# Altium project RF19_Sensor_CAN_Module.PrjPcb
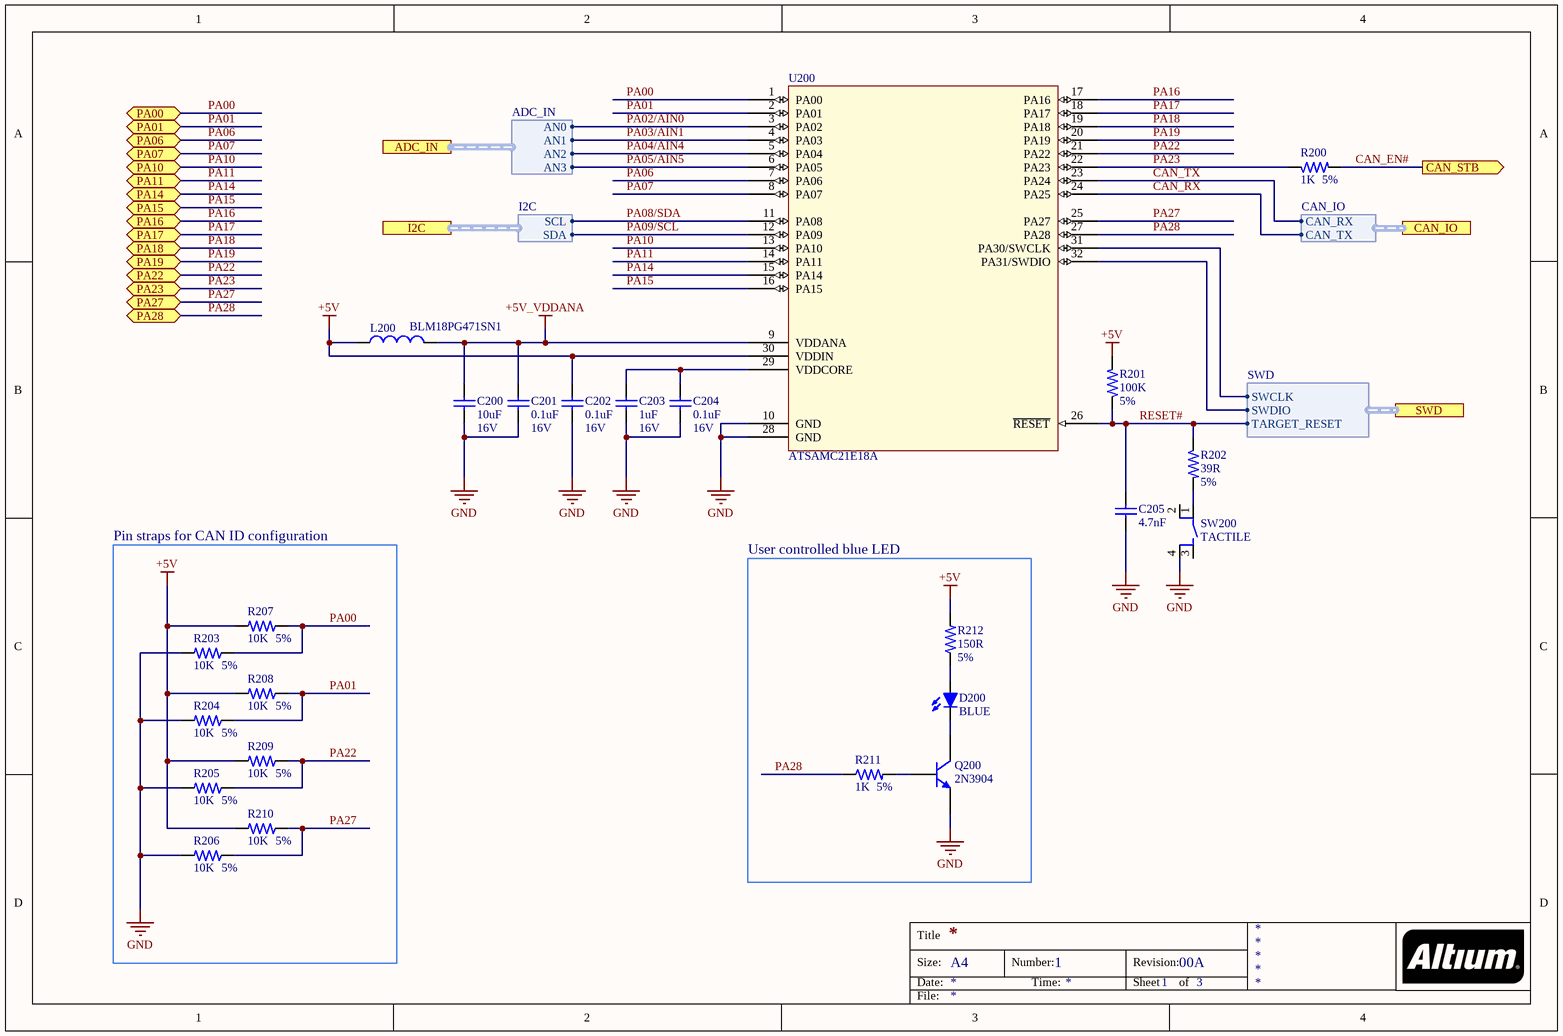
[diagram p0: RF19_Sensor_CAN_Module_MCU.SchDoc]
3 sheets, 64 parts. Net scope: flat (ports and power ports of the same name join across sheets).
Board file: RF19_Sensor_CAN_Module.PcbDoc
Sheets:
  RF19_Sensor_CAN_Module_MCU.SchDoc
  RF19_Sensor_CAN_Module_Power.SchDoc
  RF19_Sensor_CAN_Module_Interfaces.SchDoc

## Sheet RF19_Sensor_CAN_Module_MCU.SchDoc
size A4; Author: Tal Zaitsev; CompanyName: Ryerson Formula Racing; Engineer: Tal Zaitsev; DocumentNumber: 1; Revision: 00A; SheetNumber: 1; SheetTotal: 3

### Parts
C200  value 10uF  Voltage: 16V  [C0603]  (hidden comment: CERAMIC CAP)
C201  value 0.1uF  Voltage: 16V  [C0402]  (hidden comment: CERAMIC CAP)
C202  value 0.1uF  Voltage: 16V  [C0402]  (hidden comment: CERAMIC CAP)
C203  value 1uF  Voltage: 16V  [C0402]  (hidden comment: CERAMIC CAP)
C204  value 0.1uF  Voltage: 16V  [C0402]  (hidden comment: CERAMIC CAP)
C205  value 4.7nF  [C0402]  (hidden comment: CAP CERAMIC)
D200  BLUE  [0603 LED]
L200  value BLM18PG471SN1  [L0603_MURATA]
Q200  2N3904  [SOT323-3L]
R200  value 1K  Tolerance: 5%  [R0402]  (hidden comment: R001K50P0402063)
R201  value 100K  Tolerance: 5%  [R0402]  (hidden comment: R100K50P0402063)
R202  value 39R  Tolerance: 5%  [R0402]  (hidden comment: R039R50P0402063)
R203  value 10K  Tolerance: 5%  [R0402]  (hidden comment: R010K50P0402063)
R204  value 10K  Tolerance: 5%  [R0402]  (hidden comment: R010K50P0402063)
R205  value 10K  Tolerance: 5%  [R0402]  (hidden comment: R010K50P0402063)
R206  value 10K  Tolerance: 5%  [R0402]  (hidden comment: R010K50P0402063)
R207  value 10K  Tolerance: 5%  [R0402]  (hidden comment: R010K50P0402063)
R208  value 10K  Tolerance: 5%  [R0402]  (hidden comment: R010K50P0402063)
R209  value 10K  Tolerance: 5%  [R0402]  (hidden comment: R010K50P0402063)
R210  value 10K  Tolerance: 5%  [R0402]  (hidden comment: R010K50P0402063)
R211  value 1K  Tolerance: 5%  [R0402]  (hidden comment: R001K50P0402063)
R212  value 150R  Tolerance: 5%  [R0402]  (hidden comment: R150R50P0402063)
SW200  TACTILE  [TACTILE GULL WING KMR7]
U200  ATSAMC21E18A  [ATMEL_TQFP-32]

### Blocks framed on the sheet
Pin straps for CAN ID configuration: R203-R210
User controlled blue LED: D200 Q200 R211 R212

### Ports
ADC_IN (harness ADC_IN), CAN_IO (harness CAN_IO), CAN_STB (out), I2C (harness I2C), PA00 (bidir), PA01 (bidir), PA06 (bidir), PA07 (bidir), PA10 (bidir), PA11 (bidir), PA14 (bidir), PA15 (bidir), PA16 (bidir), PA17 (bidir), PA18 (bidir), PA19 (bidir), PA22 (bidir), PA23 (bidir), PA27 (bidir), PA28 (bidir), SWD (harness SWD)

### Harnesses
SWD: SWCLK, SWDIO, TARGET_RESET
CAN_IO: CAN_RX, CAN_TX
ADC_IN: AN0, AN1, AN2, AN3
I2C: SCL, SDA

### Nets
+5V: C202.1 L200.1 R201.2 R207.2 R208.2 R209.2 R210.2 R212.2 U200.30(VDDIN)
+5V_VDDANA: C200.1 C201.1 L200.2 U200.9(VDDANA)
GND: C200.2 C201.2 C202.2 C203.2 C204.2 C205.2 Q200.3(E) R203.2 R204.2 R205.2 R206.2 SW200.4 U200.10(GND) U200.28(GND)
CAN_EN#: R200.2 ; port CAN_STB
CAN_RX: U200.24(PA25) ; port CAN_IO.CAN_TX
CAN_TX: U200.23(PA24) ; port CAN_IO.CAN_RX
PA00: R203.1 R207.1 U200.1(PA00) ; port PA00
PA01: R204.1 R208.1 U200.2(PA01) ; port PA01
PA02/AIN0: U200.3(PA02) ; port ADC_IN.AN0
PA03/AIN1: U200.4(PA03) ; port ADC_IN.AN1
PA04/AIN4: U200.5(PA04) ; port ADC_IN.AN2
PA05/AIN5: U200.6(PA05) ; port ADC_IN.AN3
PA06: U200.7(PA06) ; port PA06
PA07: U200.8(PA07) ; port PA07
PA08/SDA: U200.11(PA08) ; port I2C.SCL
PA09/SCL: U200.12(PA09) ; port I2C.SDA
PA10: U200.13(PA10) ; port PA10
PA11: U200.14(PA11) ; port PA11
PA14: U200.15(PA14) ; port PA14
PA15: U200.16(PA15) ; port PA15
PA16: U200.17(PA16) ; port PA16
PA17: U200.18(PA17) ; port PA17
PA18: U200.19(PA18) ; port PA18
PA19: U200.20(PA19) ; port PA19
PA22: R205.1 R209.1 U200.21(PA22) ; port PA22
PA23: R200.1 U200.22(PA23) ; port PA23
PA27: R206.1 R210.1 U200.25(PA27) ; port PA27
PA28: R211.1 U200.27(PA28) ; port PA28
RESET#: C205.1 R201.1 R202.1 U200.26(~{RESET}) ; port SWD.TARGET_RESET
NetC203_1: C203.1 C204.1 U200.29(VDDCORE)
NetD200_A: D200.A R212.1
NetD200_C: D200.C Q200.1(C)
NetJ100_2: U200.32(PA31/SWDIO) ; port SWD.SWDIO
NetJ100_4: U200.31(PA30/SWCLK) ; port SWD.SWCLK
NetQ200_2: Q200.2(B) R211.2
NetR202_2: R202.2 SW200.1

Not connected (* = marked no-connect by the designer): SW200 2 3

### Notes on the sheet
- Title
- Size:
- Date:
- A4
- Number:
- Time:
- Revision:
- Sheet
- of
- File:

### Library data of the parts
C200 = C010U10P16VX5R0603: Ceramic cap, 10uF +/-10% 16V X5R 0603; Supplier 1: Mouser; Supplier 2: Digi-Key; Supplier Part Number 1: 81-GRM188R61C106KALD; Supplier Part Number 2: 490-10728-1-ND
C201 C202 C204 = C00U110P16VX5R0402: Ceramic cap, 0.1uF +/-10% 16V X5R 0402; Supplier 1: Mouser; Supplier Part Number 1: 581-0402YD104K; Supplier 2: Digi-Key; Supplier Part Number 2: 478-1126-1-ND
C203 = C001U10P16VX5R0402: Ceramic cap, 1uF +/-10% 16V X5R 0402; Supplier 1: Mouser; Supplier 2: Digi-Key; Supplier Part Number 1: 963-EMK105BJ105KV-F; Supplier Part Number 2: 1276-1067-1-ND
C205 = CAP CERAMIC: Ceramic capacitor
D200 = D0603BLUE: LED Blue, 0603 3.3V 20mA; Supplier 1: Mouser; Supplier Part Number 1: 859-LTST-C191TBKT; ComponentLink1Description: Datasheet; ComponentLink1URL: http://optoelectronics.liteon.com/upload/download/DS22-2000-230/LTST-C191TBKT.pdf; Supplier 2: Digi-Key; Supplier Part Number 2: 160-1647-6-ND
L200 = A03-0035: SMD RF inductor 0603. Z=470Ohm (@100MHz), Max R(dc)=0.65Ohm, Max current=1A; PartGroup: Inductors,EMI; Manufacturer: Murata; Tolerance: ±25%; TemperatureRange: -55°C to +125°C; AN: A03-0035; Height: 0,800000011920929; MPN: BLM18PG471SN1; Supplier 1: Digi-Key; Supplier Part Number 1: 490-5223-1-ND; Supplier 2: Mouser; Supplier Part Number 2: 81-BLM18PG471SN1D
Q200 = QNPN: NPN Bipolar Transistor; Published: 8-Jun-2000; LatestRevisionDate: 29-May-2009; LatestRevisionNote: IPC-7351 Footprint Added.; PackageVersion: Aug-1999; PackageReference: SOT-23B; Publisher: Altium Limited; PackageDescription: 3-Pin SOT-23 Package 0.95 mm Pitch, 2.4 mm Lead Span; Supplier 1: Digi-Key; Supplier Part Number 1: MMBT3904WT1GOSDKR-ND; Supplier 2: Mouser; Supplier Part Number 2: 863-MMBT3904WT1G
R200 R211 = R001K50P0402063: Resistor 1K 5% 0402 1/16W; Supplier 1: Mouser; Supplier Part Number 1: 603-RC0402JR-071KL; ComponentLink1Description: Datasheet; ComponentLink1URL: http://www.yageo.com/documents/recent/PYu-RC_Group_51_RoHS_L_9.pdf; Supplier 2: Digi-Key; Supplier Part Number 2: 311-1.0KJRDKR-ND
R201 = R100K50P0402063: Resistor 100K 5% 0402 1/16W; Supplier 1: Mouser; Supplier Part Number 1: 603-RC0402JR-07100KL; ComponentLink1Description: Datasheet; ComponentLink1URL: http://www.yageo.com/documents/recent/PYu-RC_Group_51_RoHS_L_9.pdf; Supplier Part Number 2: 311-100KJRDKR-ND; Supplier 2: Digi-Key
R202 = R039R50P0402063: Resistor 39R 5% 0402 1/16W; Supplier 1: Mouser; Supplier Part Number 1: 603-RC0402JR-0739RL; Supplier 2: Digi-Key; Supplier Part Number 2: 311-39JRCT-ND; ComponentLink1Description: Datasheet; ComponentLink1URL: http://www.yageo.com/documents/recent/PYu-RC_Group_51_RoHS_L_9.pdf
R203-R210 = R010K50P0402063: Resistor 10K 5% 0402 1/16W; Supplier 1: Digi-Key; Supplier Part Number 1: 311-10KJRDKR-ND; ComponentLink1Description: Datasheet; ComponentLink1URL: http://www.yageo.com/documents/recent/PYu-RC_Group_51_RoHS_L_9.pdf; Supplier 2: Mouser; Supplier Part Number 2: 603-RC0402JR-0710KL
R212 = R150R50P0402063: Resistor 150R 5% 0402 1/16W; Supplier 1: Mouser; Supplier Part Number 1: 603-RC0402JR-07150RL; ComponentLink1Description: Datasheet; ComponentLink1URL: http://www.yageo.com/documents/recent/PYu-RC_Group_51_RoHS_L_9.pdf; Supplier 2: Digi-Key; Supplier Part Number 2: 311-150JRDKR-ND
SW200 = SWITCH TACTILE ALT: Tactile Switch SPST-NO Top Actuated Surface Mount; Supplier 1: Mouser; Supplier Part Number 1: 611-PTS810SJS250SMTR; ComponentLink1Description: Datasheet; ComponentLink1URL: https://www.ckswitches.com/media/1476/pts810.pdf; Supplier 2: Digi-Key; Supplier Part Number 2: CKN10878CT-ND
U200 = ATSAMC21E18A: Atmel SAM ARM Cortex-M0+ 32-bit MCU

## Sheet RF19_Sensor_CAN_Module_Power.SchDoc
size A; DocumentNumber: 2; SheetNumber: 2; SheetTotal: 3
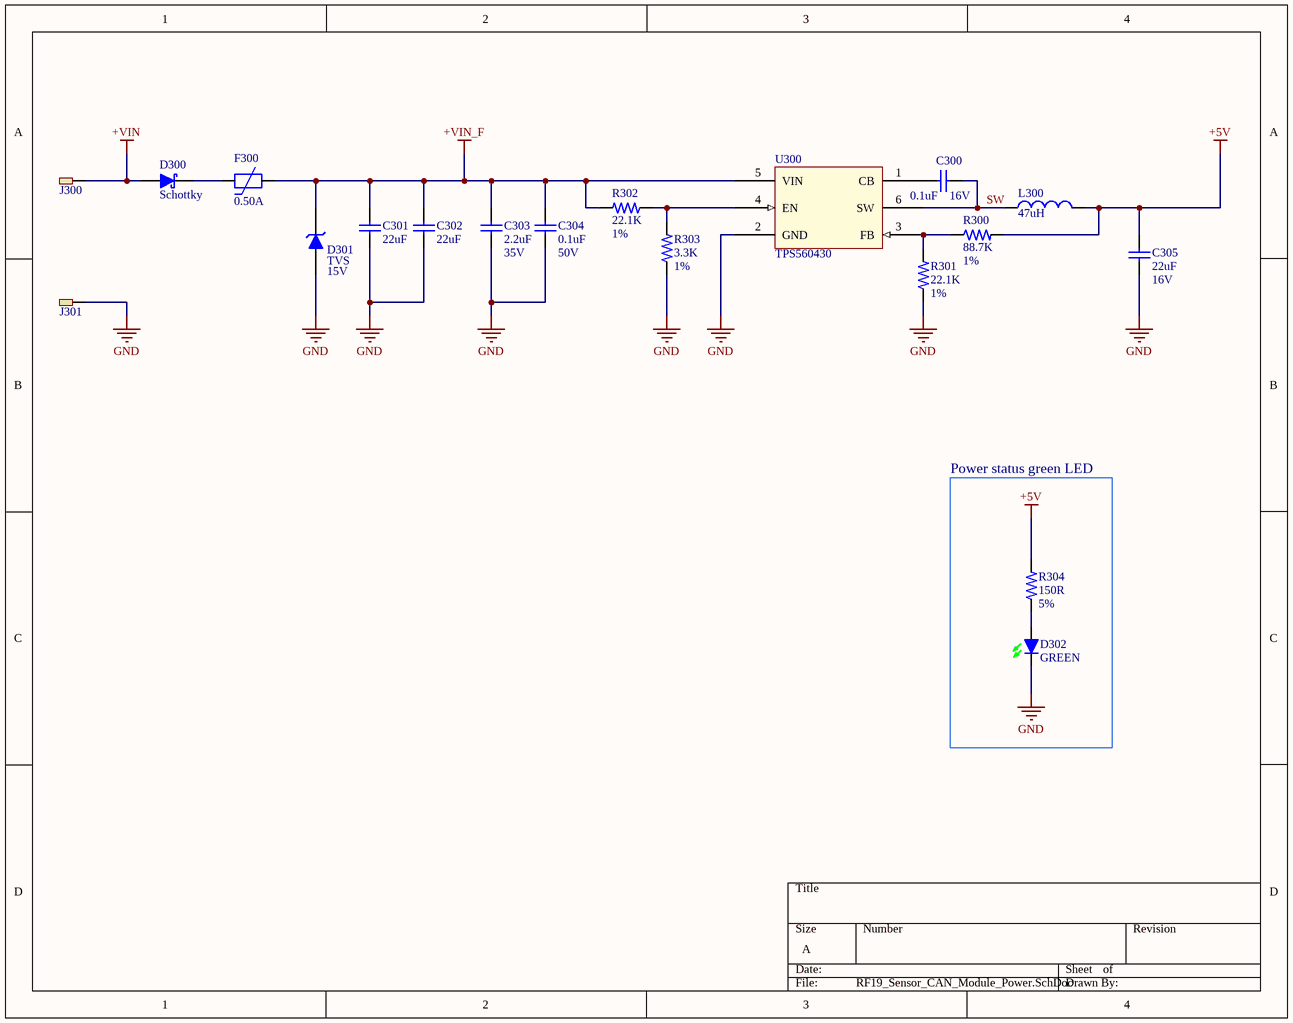
[diagram p1: RF19_Sensor_CAN_Module_Power.SchDoc]

### Parts
C300  value 0.1uF  Voltage: 16V  [C0402]  (hidden comment: C00U110P16VX5R0402)
C301  value 22uF  [C1206]  (hidden comment: CERAMIC CAP)
C302  value 22uF  [C1206]  (hidden comment: CERAMIC CAP)
C303  value 2.2uF  Voltage: 35V  [C0603]  (hidden comment: C02U210P35VX5R0603)
C304  value 0.1uF  Voltage: 50V  [C0603]  (hidden comment: CERAMIC CAP)
C305  value 22uF  Voltage: 16V  [C0805]  (hidden comment: CERAMIC CAP)
D300  Schottky  [SOD-123W]
D301  TVS  value 15V  [DO-214AC]
D302  GREEN  [0603 LED]
F300  0.50A  [PTC 1206]
J300  BREAKOUT  [BREAKOOUT PAD]  (value not drawn)  (no BOM)
J301  BREAKOUT  [BREAKOOUT PAD]  (value not drawn)  (no BOM)
L300  value 47uH  [SRN4018TA]  (hidden comment: Inductor)
R300  value 88.7K  Tolerance: 1%  [R0402]  (hidden comment: R88K710P0402063)
R301  value 22.1K  Tolerance: 1%  [R0402]  (hidden comment: R22K110P0402063)
R302  value 22.1K  Tolerance: 1%  [R0402]  (hidden comment: R22K110P0402063)
R303  value 3.3K  Tolerance: 1%  [R0402]  (hidden comment: R03K310P0402063)
R304  value 150R  Tolerance: 5%  [R0402]  (hidden comment: R150R50P0402063)
U300  TPS560430  [TI_SOP8_R-PDSO-G6]

### Blocks framed on the sheet
Power status green LED: D302 R304

### Nets
+5V: C305.1 L300.2 R300.2 R304.2
+VIN: D300.A J300.1
+VIN_F: C301.1 C302.1 C303.1 C304.1 D301.C F300.2 R302.2 U300.5(VIN)
GND: C301.2 C302.2 C303.2 C304.2 C305.2 D301.A D302.C J301.1 R301.1 R303.1 U300.2(GND)
SW: C300.1 L300.1 U300.6(SW)
NetC300_2: C300.2 U300.1(CB)
NetD300_C: D300.C F300.1
NetD302_A: D302.A R304.1
NetR300_1: R300.1 R301.2 U300.3(FB)
NetR302_1: R302.1 R303.2 U300.4(EN)

### Library data of the parts
C300 = C00U110P16VX5R0402: Ceramic cap, 0.1uF +/-10% 16V X5R 0402; Supplier 1: Mouser; Supplier 2: Digi-Key; Supplier Part Number 1: 581-0402YD104K; Supplier Part Number 2: 478-1126-1-ND
C301 C302 = CAP CERAMIC: Ceramic capacitor
C303 = C02U210P35VX5R0603: Ceramic cap, 2.2uF +/-10% 35V X5R 0603; Supplier 1: Mouser; Supplier Part Number 1: 81-GRM188R6YA225KA2D; Supplier 2: Digi-Key; Supplier Part Number 2: 490-7204-1-ND
C304 = C00U110P50VX7R0603: Ceramic cap, 0.1uF +/-10% 50V X7R 0603; Supplier 1: Mouser; Supplier Part Number 1: 80-C0603C104K5REAUTO; Supplier 2: Digi-Key; Supplier Part Number 2: 399-14105-1-ND
C305 = C022U20P16VX5R0805: Ceramic cap, 22uF +/-20% 16V X5R 0805; Supplier 1: Mouser; Supplier Part Number 1: 81-GRM219R61C226ME1K
D300 = DIODE SCHOTTKY: High speed Schottky Diode; Supplier 1: Mouser; Supplier Part Number 1: 771-PMEG6020ER-115; Supplier 2: Digi-Key; Supplier Part Number 2: 1727-5217-1-ND
D301 = DIODE TVS: TVS protection diode; Power: 1W; Supplier 1: Mouser; Supplier Part Number 1: 621-SMAJ15A-13-F; Supplier 2: Digi-Key; Supplier Part Number 2: SMAJ15A-FDICT-ND
D302 = D0603GREEN: LED Green, 0603 2.0V 20mA; ComponentLink1Description: Datasheet; ComponentLink1URL: http://optoelectronics.liteon.com/upload/download/DS22-2000-230/LTST-C191TBKT.pdf; Supplier 1: Mouser; Supplier 2: Digi-Key; Supplier Part Number 1: 859-LTST-C190KGKT; Supplier Part Number 2: 160-1435-6-ND
F300 = PTC: PTC RESETTBLE 0.50A 9V 0805; Supplier 1: Mouser; Supplier Part Number 1: 530-0ZCJ0050AF2E; Supplier 2: Digi-Key; Supplier Part Number 2: 507-1803-1-ND
J300 J301 = BREAKOUT: Breakout pad for later extension
L300 = Inductor: Code_IEC: 1005; Published: 8-Jun-2000; LatestRevisionDate: 29-May-2009; LatestRevisionNote: IPC-7351 Footprint Added.; PackageReference: 0402-A; Publisher: Altium Limited; PackageDescription: Chip Inductor; Code_JEITA: 0402; Supplier 1: Mouser; Supplier Part Number 1: 652-SRN4018TA-470M; Supplier 2: Digi-Key; Supplier Part Number 2: SRN4018TA-470MCT-ND
R300 = R88K710P0402063: Resistor 88.7K 1% 0402 1/16W; ComponentLink1Description: Datasheet; ComponentLink1URL: http://www.yageo.com/documents/recent/PYu-RC_Group_51_RoHS_L_9.pdf; Supplier 1: Mouser; Supplier Part Number 1: 603-RC0402FR-0788K7L; Supplier 2: Digi-Key; Supplier Part Number 2: 311-88.7KLRCT-ND; Supplier 3: Mouser; Supplier Part Number 3: 603-AC0402FR-0788K7L
R301 R302 = R22K110P0402063: Resistor 22.1K 1% 0402 1/16W; ComponentLink1Description: Datasheet; ComponentLink1URL: http://www.yageo.com/documents/recent/PYu-RC_Group_51_RoHS_L_9.pdf; Supplier 1: Mouser; Supplier Part Number 1: 603-RC0402FR-0722K1L; Supplier 2: Digi-Key; Supplier Part Number 2: 311-22.1KLRCT-ND
R303 = R03K310P0402063: Resistor 3.3K 1% 0402 1/16W; ComponentLink1Description: Datasheet; ComponentLink1URL: http://www.yageo.com/documents/recent/PYu-RC_Group_51_RoHS_L_9.pdf; Supplier 1: Mouser; Supplier Part Number 1: 603-RC0402FR-073K3L; Supplier 2: Digi-Key; Supplier Part Number 2: 311-3.30KLRDKR-ND
R304 = R150R50P0402063: Resistor 150R 5% 0402 1/16W; ComponentLink1Description: Datasheet; ComponentLink1URL: http://www.yageo.com/documents/recent/PYu-RC_Group_51_RoHS_L_9.pdf; Supplier 1: Mouser; Supplier 2: Digi-Key; Supplier Part Number 1: 603-RC0402JR-07150RL; Supplier Part Number 2: 311-150JRDKR-ND
U300 = TPS560430: Supplier 1: Mouser; Supplier Part Number 1: 595-TPS560430YFDBVT; Supplier 2: Digi-Key; Supplier Part Number 2: 296-50224-1-ND

## Sheet RF19_Sensor_CAN_Module_Interfaces.SchDoc
size A4; DocumentNumber: 3; SheetNumber: 3; SheetTotal: 3
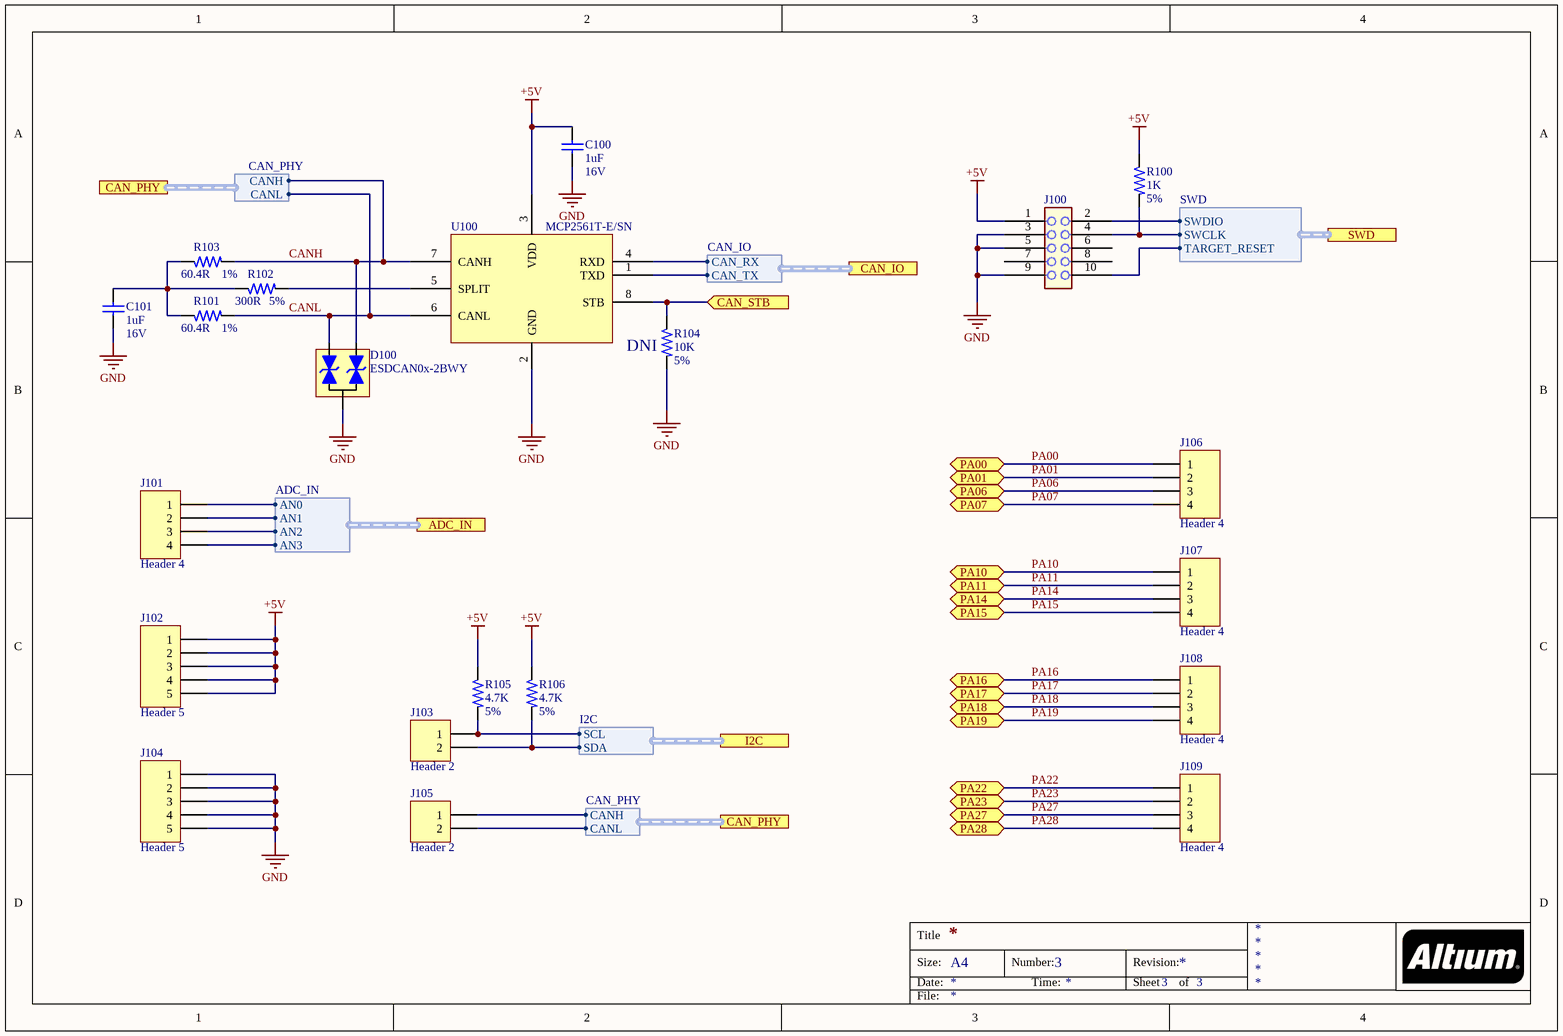
[diagram p2: RF19_Sensor_CAN_Module_Interfaces.SchDoc]

### Parts
C100  value 1uF  Voltage: 16V  [C0402]  (hidden comment: CERAMIC CAP)
C101  value 1uF  Voltage: 16V  [C0402]  (hidden comment: C001U10P16VX5R0402)
D100  ESDCAN0x-2BWY  [SOT323-3L]
J100  (no value)  [5X2 HEADER]
J101  Header 4  [HDR1X4]  (no BOM)
J102  Header 5  [HDR1X5]  (no BOM)
J103  Header 2  [HDR1X2]  (no BOM)
J104  Header 5  [HDR1X5]  (no BOM)
J105  Header 2  [HDR1X2]  (no BOM)
J106  Header 4  [HDR1X4]  (no BOM)
J107  Header 4  [HDR1X4]  (no BOM)
J108  Header 4  [HDR1X4]  (no BOM)
J109  Header 4  [HDR1X4]  (no BOM)
R100  value 1K  Tolerance: 5%  [R0402]  (hidden comment: R001K50P0402063)
R101  value 60.4R  Tolerance: 1%  [R0805]  (hidden comment: R60R410P0805125)
R102  value 300R  Tolerance: 5%  [R0402]  (hidden comment: R300R50P0402063)
R103  value 60.4R  Tolerance: 1%  [R0805]  (hidden comment: R60R410P0805125)
R104  value 10K  Tolerance: 5%  [R0402]  (hidden comment: R010K50P0402063)
R105  value 4.7K  Tolerance: 5%  [R0402]  (hidden comment: R04K750P0402063)
R106  value 4.7K  Tolerance: 5%  [R0402]  (hidden comment: R04K750P0402063)
U100  MCP2561T-E/SN  [SOIC127P600X175-8N]

### Ports
ADC_IN (harness ADC_IN), CAN_IO (harness CAN_IO), CAN_PHY (harness CAN_PHY), CAN_STB (in), I2C (harness I2C), PA00 (bidir), PA01 (bidir), PA06 (bidir), PA07 (bidir), PA10 (bidir), PA11 (bidir), PA14 (bidir), PA15 (bidir), PA16 (bidir), PA17 (bidir), PA18 (bidir), PA19 (bidir), PA22 (bidir), PA23 (bidir), PA27 (bidir), PA28 (bidir), SWD (harness SWD)

### Harnesses
CAN_IO: CAN_RX, CAN_TX
CAN_PHY: CANH, CANL
ADC_IN: AN0, AN1, AN2, AN3
I2C: SCL, SDA
SWD: SWCLK, SWDIO, TARGET_RESET

### Nets
+5V: C100.1 J100.1 J102.1 J102.2 J102.3 J102.4 J102.5 R100.1 R105.1 R106.1 U100.3(VDD)
GND: C100.2 C101.2 D100.3 J100.3 J100.5 J100.9 J104.1 J104.2 J104.3 J104.4 J104.5 R104.2 U100.2(GND)
CAN_EN#: R104.1 U100.8(STB) ; port CAN_STB
CAN_RX: U100.1(TXD) ; port CAN_IO.CAN_TX
CAN_TX: U100.4(RXD) ; port CAN_IO.CAN_RX
CANH: D100.1 J105.1 R103.2 U100.7(CANH) ; port CAN_PHY.CANH
CANL: D100.2 J105.2 R101.2 U100.6(CANL) ; port CAN_PHY.CANL
PA00: J106.1 ; port PA00
PA01: J106.2 ; port PA01
PA02/AIN0: J101.1 ; port ADC_IN.AN0
PA03/AIN1: J101.2 ; port ADC_IN.AN1
PA04/AIN4: J101.3 ; port ADC_IN.AN2
PA05/AIN5: J101.4 ; port ADC_IN.AN3
PA06: J106.3 ; port PA06
PA07: J106.4 ; port PA07
PA08/SDA: J103.1 R105.2 ; port I2C.SCL
PA09/SCL: J103.2 R106.2 ; port I2C.SDA
PA10: J107.1 ; port PA10
PA11: J107.2 ; port PA11
PA14: J107.3 ; port PA14
PA15: J107.4 ; port PA15
PA16: J108.1 ; port PA16
PA17: J108.2 ; port PA17
PA18: J108.3 ; port PA18
PA19: J108.4 ; port PA19
PA22: J109.1 ; port PA22
PA23: J109.2 ; port PA23
PA27: J109.3 ; port PA27
PA28: J109.4 ; port PA28
RESET#: J100.10 ; port SWD.TARGET_RESET
NetC101_1: C101.1 R101.1 R102.1 R103.1
NetJ100_2: J100.2 ; port SWD.SWDIO
NetJ100_4: J100.4 R100.2 ; port SWD.SWCLK
NetR102_2: R102.2 U100.5(SPLIT)

Not connected (* = marked no-connect by the designer): J100 6 7 8

### Notes on the sheet
- DNI
- Title
- Size:
- Date:
- A4
- Number:
- Time:
- Revision:
- Sheet
- of
- File:

### Library data of the parts
C100 C101 = C001U10P16VX5R0402: Ceramic cap, 1uF +/-10% 16V X5R 0402; Supplier 1: Mouser; Supplier 2: Digi-Key; Supplier Part Number 1: 963-EMK105BJ105KV-F; Supplier Part Number 2: 1276-1067-1-ND
D100 = ESDCAN0x-2BWY: Dual-line Transil TVS diodes for CAN bus; Supplier 1: Mouser; Supplier Part Number 1: 511-ESDCAN03-2BWY
J100 = A08-0385: 2x5 pin header, 1.27mm pitch, THM; PartGroup: Mechanical devices,Connectors,Pin headers; Manufacturer: Garry; MPN: 176-2-010-0-T-XS0-0730; Value: PIN HEADER 2x5; AN: A08-0385; Height: 7,30000019073486; Supplier 1: Mouser; Supplier Part Number 1: 649-221121-00010D4LF
J101 J106-J109 = Header 4: Header, 4-Pin; LatestRevisionDate: 17-Jul-2002; LatestRevisionNote: Re-released for DXP Platform.; Publisher: Altium Limited
J102 J104 = Header 5: Header, 5-Pin; LatestRevisionDate: 17-Jul-2002; LatestRevisionNote: Re-released for DXP Platform.; Publisher: Altium Limited
J103 J105 = Header 2: Header, 2-Pin; LatestRevisionDate: 17-Jul-2002; LatestRevisionNote: Re-released for DXP Platform.; Publisher: Altium Limited
R100 = R001K50P0402063: Resistor 1K 5% 0402 1/16W; ComponentLink1Description: Datasheet; ComponentLink1URL: http://www.yageo.com/documents/recent/PYu-RC_Group_51_RoHS_L_9.pdf; Supplier 1: Mouser; Supplier 2: Digi-Key; Supplier Part Number 1: 603-RC0402JR-071KL; Supplier Part Number 2: 311-1.0KJRDKR-ND
R101 R103 = R60R410P0805125: Resistor 60.4R 1% 0805 1/8W; ComponentLink1Description: Datasheet; ComponentLink1URL: https://www.mouser.ca/datasheet/2/54/hpreztr-777398.pdf; Supplier 1: Mouser; Supplier Part Number 1: 652-CR0805FX-60R4ELF
R102 = R300R50P0402063: Resistor 300R 5% 0402 1/16W; ComponentLink1Description: Datasheet; ComponentLink1URL: http://www.yageo.com/documents/recent/PYu-RC_Group_51_RoHS_L_9.pdf; Supplier 2: Digi-Key; Supplier Part Number 1: 603-RC0402JR-07300RL; Supplier 1: Mouser; Supplier Part Number 2: 311-300JRDKR-ND
R104 = R010K50P0402063: Resistor 10K 5% 0402 1/16W; ComponentLink1Description: Datasheet; ComponentLink1URL: http://www.yageo.com/documents/recent/PYu-RC_Group_51_RoHS_L_9.pdf; Supplier 1: Digi-Key; Supplier Part Number 1: 311-10KJRDKR-ND; Supplier 2: Mouser; Supplier Part Number 2: 603-RC0402JR-0710KL
R105 R106 = R04K750P0402063: Resistor 4.7K 5% 0402 1/16W; ComponentLink1Description: Datasheet; ComponentLink1URL: http://www.yageo.com/documents/recent/PYu-RC_Group_51_RoHS_L_9.pdf; Supplier 1: Mouser; Supplier 2: Digi-Key; Supplier Part Number 1: 603-RC0402JR-074K7L; Supplier Part Number 2: 311-4.7KJRDKR-ND
U100 = MCP2561: High Speed CAN Transceiver; Supplier 1: Mouser; Supplier Part Number 1: 579-MCP2561T-E/SN; Supplier 2: Digi-Key; Supplier Part Number 2: MCP2561T-E/SNCT-ND

## Nets that join several sheets
+5V: RF19_Sensor_CAN_Module_MCU (9 pins), RF19_Sensor_CAN_Module_Power (C305.1 L300.2 R300.2 R304.2), RF19_Sensor_CAN_Module_Interfaces (11 pins)
GND: RF19_Sensor_CAN_Module_MCU (14 pins), RF19_Sensor_CAN_Module_Power (11 pins), RF19_Sensor_CAN_Module_Interfaces (13 pins)
CAN_EN#: RF19_Sensor_CAN_Module_MCU (R200.2), RF19_Sensor_CAN_Module_Interfaces (R104.1 U100.8)
CAN_RX: RF19_Sensor_CAN_Module_MCU (U200.24), RF19_Sensor_CAN_Module_Interfaces (U100.1)
CAN_TX: RF19_Sensor_CAN_Module_MCU (U200.23), RF19_Sensor_CAN_Module_Interfaces (U100.4)
NetJ100_2: RF19_Sensor_CAN_Module_MCU (U200.32), RF19_Sensor_CAN_Module_Interfaces (J100.2)
NetJ100_4: RF19_Sensor_CAN_Module_MCU (U200.31), RF19_Sensor_CAN_Module_Interfaces (J100.4 R100.2)
PA00: RF19_Sensor_CAN_Module_MCU (R203.1 R207.1 U200.1), RF19_Sensor_CAN_Module_Interfaces (J106.1)
PA01: RF19_Sensor_CAN_Module_MCU (R204.1 R208.1 U200.2), RF19_Sensor_CAN_Module_Interfaces (J106.2)
PA02/AIN0: RF19_Sensor_CAN_Module_MCU (U200.3), RF19_Sensor_CAN_Module_Interfaces (J101.1)
PA03/AIN1: RF19_Sensor_CAN_Module_MCU (U200.4), RF19_Sensor_CAN_Module_Interfaces (J101.2)
PA04/AIN4: RF19_Sensor_CAN_Module_MCU (U200.5), RF19_Sensor_CAN_Module_Interfaces (J101.3)
PA05/AIN5: RF19_Sensor_CAN_Module_MCU (U200.6), RF19_Sensor_CAN_Module_Interfaces (J101.4)
PA06: RF19_Sensor_CAN_Module_MCU (U200.7), RF19_Sensor_CAN_Module_Interfaces (J106.3)
PA07: RF19_Sensor_CAN_Module_MCU (U200.8), RF19_Sensor_CAN_Module_Interfaces (J106.4)
PA08/SDA: RF19_Sensor_CAN_Module_MCU (U200.11), RF19_Sensor_CAN_Module_Interfaces (J103.1 R105.2)
PA09/SCL: RF19_Sensor_CAN_Module_MCU (U200.12), RF19_Sensor_CAN_Module_Interfaces (J103.2 R106.2)
PA10: RF19_Sensor_CAN_Module_MCU (U200.13), RF19_Sensor_CAN_Module_Interfaces (J107.1)
PA11: RF19_Sensor_CAN_Module_MCU (U200.14), RF19_Sensor_CAN_Module_Interfaces (J107.2)
PA14: RF19_Sensor_CAN_Module_MCU (U200.15), RF19_Sensor_CAN_Module_Interfaces (J107.3)
PA15: RF19_Sensor_CAN_Module_MCU (U200.16), RF19_Sensor_CAN_Module_Interfaces (J107.4)
PA16: RF19_Sensor_CAN_Module_MCU (U200.17), RF19_Sensor_CAN_Module_Interfaces (J108.1)
PA17: RF19_Sensor_CAN_Module_MCU (U200.18), RF19_Sensor_CAN_Module_Interfaces (J108.2)
PA18: RF19_Sensor_CAN_Module_MCU (U200.19), RF19_Sensor_CAN_Module_Interfaces (J108.3)
PA19: RF19_Sensor_CAN_Module_MCU (U200.20), RF19_Sensor_CAN_Module_Interfaces (J108.4)
PA22: RF19_Sensor_CAN_Module_MCU (R205.1 R209.1 U200.21), RF19_Sensor_CAN_Module_Interfaces (J109.1)
PA23: RF19_Sensor_CAN_Module_MCU (R200.1 U200.22), RF19_Sensor_CAN_Module_Interfaces (J109.2)
PA27: RF19_Sensor_CAN_Module_MCU (R206.1 R210.1 U200.25), RF19_Sensor_CAN_Module_Interfaces (J109.3)
PA28: RF19_Sensor_CAN_Module_MCU (R211.1 U200.27), RF19_Sensor_CAN_Module_Interfaces (J109.4)
RESET#: RF19_Sensor_CAN_Module_MCU (C205.1 R201.1 R202.1 U200.26), RF19_Sensor_CAN_Module_Interfaces (J100.10)